# Altium schematic sheet Low-Side.SchDoc
size A4
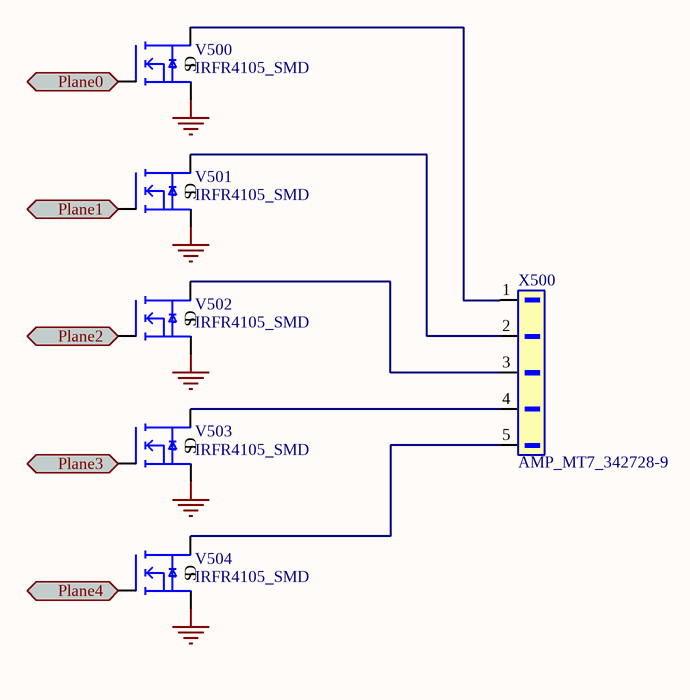
[diagram p0: Low-Side.SchDoc]

## Parts
V500  IRFR4105_SMD  [DPAK_R]
V501  IRFR4105_SMD  [DPAK_R]
V502  IRFR4105_SMD  [DPAK_R]
V503  IRFR4105_SMD  [DPAK_R]
V504  IRFR4105_SMD  [DPAK_R]
X500  AMP_MT7_342728-9  [MT7_342728-9]

## Ports
Plane0 (in), Plane1 (in), Plane2 (in), Plane3 (in), Plane4 (in)

## Nets
GND: V500.3(S) V501.3(S) V502.3(S) V503.3(S) V504.3(S)
Plane0: V500.1(G) ; port Plane0
Plane1: V501.1(G) ; port Plane1
Plane2: V502.1(G) ; port Plane2
Plane3: V503.1(G) ; port Plane3
Plane4: V504.1(G) ; port Plane4
NetV500_2: V500.2(D) X500.1
NetV501_2: V501.2(D) X500.2
NetV502_2: V502.2(D) X500.3
NetV503_2: V503.2(D) X500.4
NetV504_2: V504.2(D) X500.5

## Library data of the parts
V500-V504 = IRFR4105_SMD: IRFR4105_MOS-FET_N_SMD
X500 = AMP_MT7_342728-9: Stiftleiste_5-polig_AMP_Inkrementalgeber_stehend=MT7_342728-9; Text Field1: 051132-33-3-32